# Altium project Longboard_32bit_ext.PrjPCB (part 4 of 6)

## Sheet DC_Power_Switching.SchDoc: STM32F412 CNC
size B; Author: AM; CompanyName: Expatria Technologies; DrawnBy: A.Marles; Engineer: AM; Organization: Expatria Technolgoies; Address1: PO Box 2084; Address3: Merritt, BC V1K 1B8; Address4: Canada; DocumentNumber: 22; Revision: B9; SheetNumber: 22; SheetTotal: 27
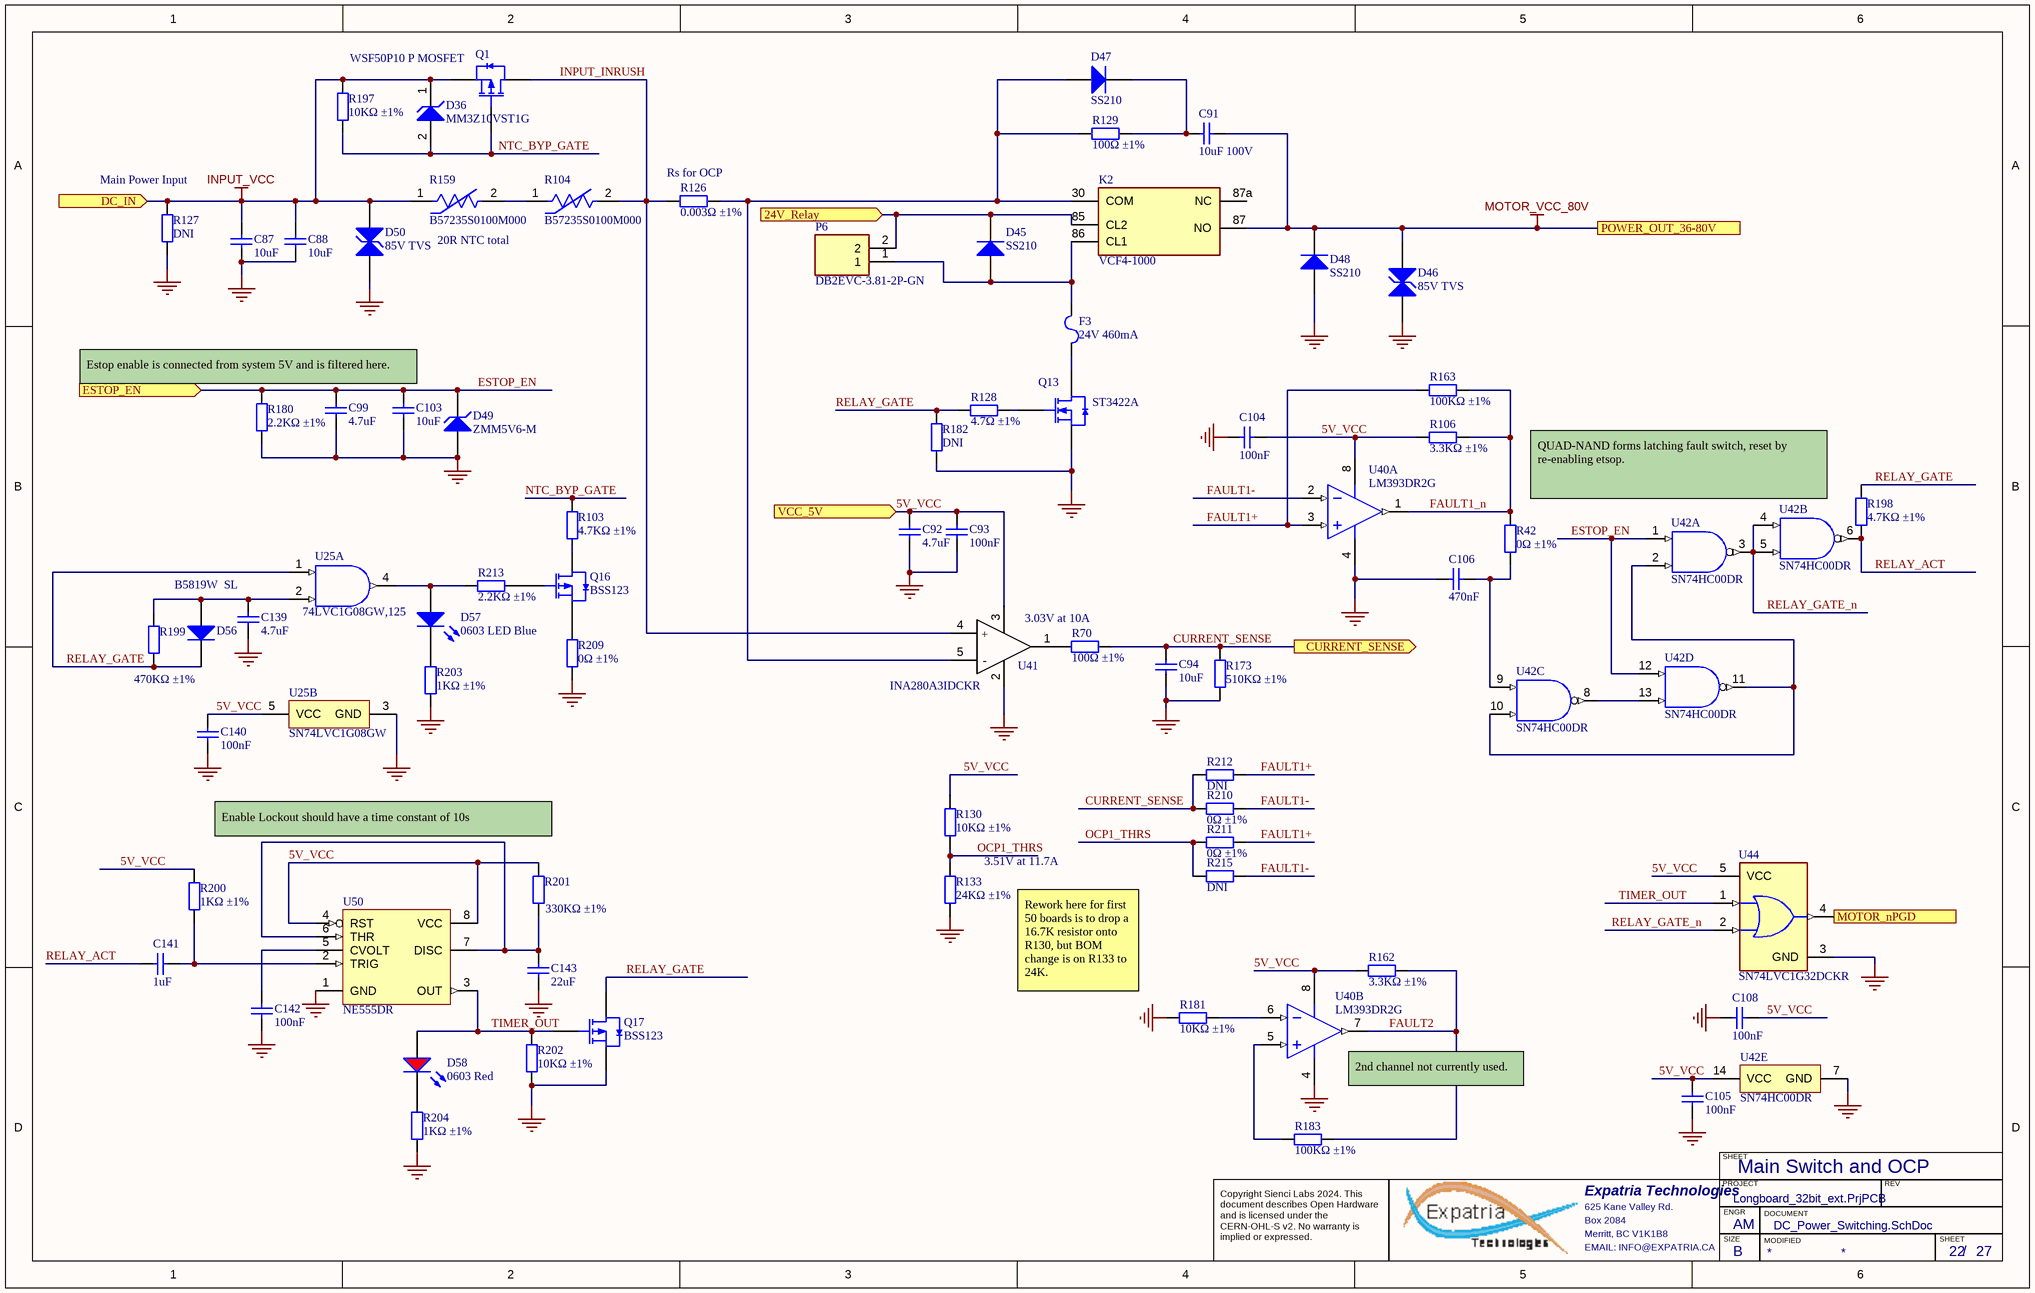
[diagram p15: DC_Power_Switching.SchDoc]

### Parts
C87  10uF  [1206_C]
C88  10uF  [1206_C]
C91  10uF 100V  [1210_C]
C92  4.7uF  [0603_C]
C93  100nF  [0603_C]
C94  10uF  [0603_C]
C99  4.7uF  [0603_C]
C103  10uF  [0603_C]
C104  100nF  [0603_C]
C105  100nF  [0603_C]
C106  470nF  [0603_C]
C108  100nF  [0603_C]
C139  4.7uF  [1206_C]
C140  100nF  [0603_C]
C141  1uF  [0603_C]
C142  100nF  [0603_C]
C143  22uF  [1206_C]
D36  MM3Z10VST1G  [ONSC-SOD-323-2-477-02_V]
D45  SS210  [SMA(DO-214AC)_S1]
D46  85V TVS  [SMB(DO-214AA)_S1]
D47  SS210  [SMA(DO-214AC)_S1]
D48  SS210  [SMA(DO-214AC)_S1]
D49  ZMM5V6-M  [LL-34]
D50  85V TVS  [SMB(DO-214AA)_S1]
D56  B5819W  SL  [SOD-123]
D57  0603 LED Blue  [0603_LED_S1 - BLUE]
D58  0603 Red  [0603_LED_S1]
F3  24V 460mA  [1206_C]
K2  VCF4-1000  [VCF41000]
P6  DB2EVC-3.81-2P-GN  [CONN-TH_5P-P3.81_DB2EVC-3.81-2p]
Q1  WSF50P10 P MOSFET  [TO-252-2-180]
Q13  ST3422A  [SOT-23-3L]
Q16  BSS123  [SOT-23-3L]
Q17  BSS123  [SOT-23-3L]
R42  0Ω ±1%  [0603_R]
R70  100Ω ±1%  [0603_R]
R103  4.7KΩ ±1%  [0603_R]
R104  B57235S0100M000  [RES-TH_L9.5-W6.0-P5.00-D0.6]
R106  3.3KΩ ±1%  [0603_R]
R126  0.003Ω ±1%  [1206_R]
R127  DNI  [0603_R]
R128  4.7Ω ±1%  [0603_R]
R129  100Ω ±1%  [1206_R]
R130  10KΩ ±1%  [0603_R]
R133  24KΩ ±1%  [0603_R]
R159  B57235S0100M000  [RES-TH_L9.5-W6.0-P5.00-D0.6]
R162  3.3KΩ ±1%  [0603_R]
R163  100KΩ ±1%  [0603_R]
R173  510KΩ ±1%  [0603_R]
R180  2.2KΩ ±1%  [0603_R]
R181  10KΩ ±1%  [0603_R]
R182  DNI  [0603_R]
R183  100KΩ ±1%  [0603_R]
R197  10KΩ ±1%  [0603_R]
R198  4.7KΩ ±1%  [0603_R]
R199  470KΩ ±1%  [0603_R]
R200  1KΩ ±1%  [0603_R]
R201  330KΩ ±1%  [0603_R]
R202  10KΩ ±1%  [0603_R]
R203  1KΩ ±1%  [0603_R]
R204  1KΩ ±1%  [0603_R]
R209  0Ω ±1%  [0603_R]
R210  0Ω ±1%  [0603_R]
R211  0Ω ±1%  [0603_R]
R212  DNI  [0603_R]
R213  2.2KΩ ±1%  [0603_R]
R215  DNI  [0603_R]
U25  74LVC1G08GW,125  [DCK0005A_M]  (parts A,B of 2)
U40  LM393DR2G  [SOIC-8_150mil]  (parts A,B of 2)
U41  INA280A3IDCKR  [SOT65P210X110-5N]
U42  SN74HC00DR  [D0014A_L]  (parts A,B,C,D,E of 5)
U44  SN74LVC1G32DCKR  [FP-DCK0005A-IPC_A]
U50  NE555DR  [SOIC-8_150mil]

### Ports
24V_Relay (in), CURRENT_SENSE (out), DC_IN (in), ESTOP_EN (in), MOTOR_nPGD (out), POWER_OUT_36-80V, VCC_5V (in)

### Nets
5V_VCC: C92.2 C93.2 C104.2 C105.2 C108.2 C140.2 R106.2 R130.2 R162.2 R200.2 R201.2 U25.5(VCC) U40.8(V+) U41.3(VS) U42.14(VCC) U44.5(VCC) U50.4(RST) U50.8(VCC) ; port VCC_5V  [project net VCC_SYS_5V0]
GND: C87.1 C88.1 C92.1 C93.1 C94.1 C99.1 C103.1 C104.1 C105.1 C106.2 C108.1 C139.1 C140.1 C142.1 C143.1 D46.1(A) D48.1(A) D49.1(A) D50.1(A) Q13.2(S) Q17.2(S) R127.1 R133.1 R173.1 R180.1 R181.2 R182.1 R202.1 R203.1 R204.1 R209.1 U25.3(GND) U40.4(GND) U41.2(GND) U42.7(GND) U44.3(GND) U50.1(GND)
INPUT_VCC: C87.2 C88.2 D36.1(K) D50.2(K) Q1.3(S) R127.2 R159.1 R197.2 ; port DC_IN
MOTOR_VCC_80V: C91.2 D46.2(K) D48.2(K) K2.87(NO) ; port POWER_OUT_36-80V
VCC_SYS_24V0: D45.2(K) K2.85(CL2) P6.2 ; port 24V_Relay
CURRENT_SENSE: C94.2 R70.2 R173.2 R210.2 R212.2 ; port CURRENT_SENSE
ESTOP_EN: C99.2 C103.2 D49.2(K) R180.2 U42.1(1A) U42.12(4A) ; port ESTOP_EN  [project net ESTOP_5V_EN]
FAULT1+: R163.1 R211.1 R212.1 U40.3(IN+)
FAULT1-: R210.1 R215.1 U40.2(IN-)
FAULT1_n: R42.2 R106.1 R163.2 U40.1(OUT)
FAULT2: R162.1 R183.2 U40.7(OUT)
INPUT_INRUSH: Q1.2(D) R104.2 R126.2 U41.4(IN+)
MOTOR_nPGD: U44.4(Y) ; port MOTOR_nPGD
NTC_BYP_GATE: D36.2(A) Q1.1(G) R103.2 R197.1
OCP1_THRS: R130.1 R133.2 R211.2 R215.2
RELAY_ACT: C141.2 R198.1 U42.6(2Y)
RELAY_GATE: D56.2(K) Q17.3(D) R128.1 R182.2 R198.2 R199.1 U25.1(A)
RELAY_GATE_n: U42.3(1Y) U42.4(2A) U42.5(2B) U44.2(B)
TIMER_OUT: D58.A Q17.1(G) R202.2 U44.1(A) U50.3(OUT)
NetC91_1: C91.1 D47.2(K) R129.2
NetC106_1: C106.1 R42.1 U42.9(3A)
NetC139_2: C139.2 D56.1(A) R199.2 U25.2(B)
NetC141_1: C141.1 R200.1 U50.2(TRIG)
NetC142_2: C142.2 U50.5(CVOLT)
NetC143_2: C143.2 R201.1 U50.6(THR) U50.7(DISC)
NetD45_1: D45.1(A) F3.2 K2.86(CL1) P6.1
NetD47_1: D47.1(A) K2.30(COM) R126.1 R129.1 U41.5(IN-)
NetD57_A: D57.A R213.2 U25.4(Y)
NetD57_K: D57.K R203.2
NetD58_K: D58.K R204.2
NetF3_1: F3.1 Q13.3(D)
NetQ13_1: Q13.1(G) R128.2
NetQ16_1: Q16.1(G) R213.1
NetQ16_2: Q16.2(S) R209.2
NetQ16_3: Q16.3(D) R103.1
NetR70_1: R70.1 U41.1(OUT)
NetR104_1: R104.1 R159.2
NetR181_1: R181.1 U40.6(IN-)
NetR183_1: R183.1 U40.5(IN+)
NetU42_2: U42.2(1B) U42.10(3B) U42.11(4Y)
NetU42_8: U42.8(3Y) U42.13(4B)

Not connected (* = marked no-connect by the designer): K2 87a(NC)

### Notes on the sheet
- (near R127) Main Power Input
- (near R126) Rs for OCP
- 20R NTC total
- Estop enable is connected from system 5V and is filtered here.
- QUAD-NAND forms latching fault switch, reset by re-enabling etsop.
- (near U41) 3.03V at 10A
- Enable Lockout should have a time constant of 10s
- 3.51V at 11.7A
- Rework here for first 50 boards is to drop a 16.7K resistor onto R130, but BOM change is on R133 to 24K.
- (near U40) 2nd channel not currently used.
- Main Switch and OCP
- SHEET
- Expatria Technologies
- 625 Kane Valley Rd.
- Box 2084
- Merritt, BC V1K1B8
- PROJECT
- SIZE
- ENGR
- MODIFIED
- DOCUMENT
- REV
- Copyright Sienci Labs 2024. This document describes Open Hardware and is licensed under the CERN-OHL-S v2. No warranty is implied or expressed.
- EMAIL: INFO@EXPATRIA.CA
- B
- /
- (in symbol INA280A3IDCKR) +; -

### Library data of the parts
C87 C88 = 1206 10uF (106) 10% 50V: 50V 10uF X5R ±10% 1206 Multilayer Ceramic Capacitors MLCC - SMD/SMT ROHS; Manufacturer: Samsung Electro-Mechanics; Manufacturer Part Number: CL31A106KBHNNNE; Package: 1206; Supplier: LC; SuppliersPartNumber: C13585; Capacitance: 10uF; Tolerance: 10%; Voltage: 50V
C91 = 1210 10uF (106) 10% 100V: Chip capacitors; Manufacturer: Murata; Manufacturer Part Number: GRM32EC72A106KE05L; Tolerance: 10%; Package: 1210; Supplier: LC; SuppliersPartNumber: C576517; Capacitance: 10uF; Voltage: 100V
C92 C99 = 0603 4.7uF (475) 10% 16V: 16V 4.7uF X5R ±10% 0603 Multilayer Ceramic Capacitors MLCC - SMD/SMT ROHS; Manufacturer: Samsung Electro-Mechanics; Manufacturer Part Number: CL10A475KO8NNNC; ComponentLink1Description: Supplier link; ComponentLink1URL: http://www.szlcsc.com/product/details_20375.html; Package: 0603; Supplier: LC; SuppliersPartNumber: C19666; Capacitance: 4.7uF; Tolerance: 10%; Voltage: 16V
C93 C104 C105 C108 C140 C142 = 0603 100nF (104) 10% 50V: 50V 100nF X7R ±10% 0603 Multilayer Ceramic Capacitors MLCC - SMD/SMT ROHS; Manufacturer: YAGEO; Manufacturer Part Number: CC0603KRX7R9BB104; Package: 0603; Supplier: LC; SuppliersPartNumber: C14663; Capacitance: 100nF; Tolerance: 10%; Voltage: 50V; ComponentLink1Description: Supplier link; ComponentLink1URL: http://www.szlcsc.com/product/details_15331.html
C94 = 0603 10uF (106) 10% 10V: Chip capacitors; Manufacturer: Samsung Electro-Mechanics; PartNumber: CL10A106KP8NNNC; Tolerance: 10%; Voltage: 10V; Package: 0603; Supplier: LC; SuppliersPartNumber: C19702; Capacitance: 10uF; ComponentLink1Description: Supplier link; ComponentLink1URL: http://www.szlcsc.com/product/details_20411.html
C103 = 0603 10uF (106) 10% 10V: Chip capacitors; Manufacturer: Samsung Electro-Mechanics; Manufacturer Part Number: CL10A106KP8NNNC; Tolerance: 10%; Voltage: 10V; ComponentLink1Description: Supplier link; ComponentLink1URL: http://www.szlcsc.com/product/details_20411.html; Package: 0603; Supplier: LC; SuppliersPartNumber: C19702; Capacitance: 10uF
C106 = 0603 470nF (474) 10% 25V: Chip capacitors; Manufacturer: Samsung Electro-Mechanics; Manufacturer Part Number: CL10B474KA8NNNC; Tolerance: 10%; Voltage: 25V; Package: 0603; Supplier: LC; SuppliersPartNumber: C1623; Capacitance: 470nF; ComponentLink1Description: Supplier link; ComponentLink1URL: http://www.szlcsc.com/product/details_1975.html
C139 = 1206 4.7uF (475) 10% 50V: Chip capacitors; Manufacturer: Guangdong Fenghua Advanced Tech; Manufacturer Part Number: 1206B475K500NT; Tolerance: 10%; Voltage: 50V; ComponentLink1Description: Supplier link; ComponentLink1URL: http://www.szlcsc.com/product/details_30577.html; Package: 1206; Supplier: LC; SuppliersPartNumber: C29823; Capacitance: 4.7uF
C141 = 0603 1uF (105) 10% 50V: as C9 on sheet RS485; Package: 0603; Supplier: LC; SuppliersPartNumber: C15849; Capacitance: 1uF; ComponentLink1Description: Supplier link; ComponentLink1URL: http://www.szlcsc.com/product/details_16531.html
C143 = 1206 4.7uF (475) 10% 50V: Chip capacitors; Manufacturer: Samsung; Manufacturer Part Number: CL31A226KAHNNNE; Tolerance: 10%; Voltage: 25V; ComponentLink1Description: Supplier link; ComponentLink1URL: http://www.szlcsc.com/product/details_30577.html; Package: 1206; Supplier: LC; SuppliersPartNumber: C12891; Capacitance: 22uF
D36 = MM3Z10VST1G: MM3Z10VST1G Zener Diode, 10V 2% 300 mW SMT 2-Pin SOD-323 | ON Semiconductor MM3Z10VST1G; Packing: Tape and Reel; P Max (W): 0.3; Material: Plastic; Max Power Dissipation: 300mW; Forward Voltage: 900mV; Impedance: 15R; Max Reverse Leakage Current: 500nA; Power Dissipation: 200mW; Test Current: 5mA; Forward Current: 10mA; Reverse Voltage: 6V; PackageVersion: Rev. H, 03/2007; Mounting Technology: Surface Mount; RoHS: Pb-Free; ComponentLink1Description: Manufacturer URL; ComponentLink3URL: http://www.onsemi.com/pub_link/Collateral/477-02.PDF.1; ComponentLink2Description: Datasheet; PackageDescription: 2-Pin SOD, Body 1.7 x 1.25 mm; PackageReference: SOD-323-2-477-02; Manufacturer Part Number: MM3Z10VST1G; ComponentLink2URL: http://www.onsemi.cn/pub_link/Collateral/MM3Z2V4ST1-D.PDF; ComponentLink1URL: http://www.onsemi.com/; DatasheetVersion: Rev. 21; ComponentLink3Description: Package Specification; Manufacturer: On Semiconductor; Supplier: LCSC; Category: Zener Diodes; Case/Package: SOD-323-2; Number of Pins: 2; Min Operating Temperature: -65°C; Max Operating Temperature: 150°C; Packaging: Tape and Reel; Zener Voltage: 10V; Package Quantity: 3000; Max Reverse Current: 500nA; Series: -; Tolerance: 2%; Voltage Tolerance: 2%; Working Voltage: 10V; Voltage Rating (DC): 10V; Power Rating: 200mW; Length: 1.8mm; Width: 1.35mm; Height: 1mm; Radiation Hardening: No; Lead Free: Lead Free; RoHS Compliant: Yes; Reach SVHC Compliant: No; ComponentLink4URL: https://datasheet.ciiva.com/15142/getdatasheetpartid-68935-15142333.pdf?src-supplier=Verical; ComponentLink4Description: https://datasheet.ciiva.com/15142/getdatasheetpartid-68935-15142333.pdf?src-supplier=Verical; ComponentLink5URL: https://datasheet.ciiva.com/8347/mm3z2v4st1-d-8347637.pdf?src-supplier=Avnet; ComponentLink5Description: https://datasheet.ciiva.com/8347/mm3z2v4st1-d-8347637.pdf?src-supplier=Avnet; ComponentLink6URL: https://datasheet.ciiva.com/10637/mm3z2v4st1-d-10637802.pdf?src-supplier=Avnet; ComponentLink6Description: https://datasheet.ciiva.com/10637/mm3z2v4st1-d-10637802.pdf?src-supplier=Avnet; ComponentLink7URL: https://datasheet.ciiva.com/894/mm3z2v4st1-d-894658.pdf?src-supplier=Digikey; ComponentLink7Description: https://datasheet.ciiva.com/894/mm3z2v4st1-d-894658.pdf?src-supplier=Digikey; ComponentLink8URL: https://datasheet.ciiva.com/894/mm3z2v4st1-d-894659.pdf?src-supplier=Digikey; ComponentLink8Description: https://datasheet.ciiva.com/894/mm3z2v4st1-d-894659.pdf?src-supplier=Digikey; ComponentLink9URL: https://datasheet.ciiva.com/894/mm3z2v4st1-d-894660.pdf?src-supplier=Digikey; ComponentLink9Description: https://datasheet.ciiva.com/894/mm3z2v4st1-d-894660.pdf?src-supplier=Digikey; Value: MM3Z10VST1G; SuppliersPartNumber: C235983
D45 D47 D48 = SMA(DO-214AC) SS210: 100V 2A 850mV @ 2A SMA(DO-214AC) Schottky Barrier Diodes (SBD) ROHS; Manufacturer: MDD(Microdiode Electronics); ComponentLink1Description: 供应商链接; ComponentLink1URL: http://www.szlcsc.com/product/details_15669.html; Package: SMA(DO-214AC); Supplier: LC; SuppliersPartNumber: C14996; Manufacturer Part Number: SS210
D46 D50 = SMBJ85CA: 4.4A 137V 94.4V 85V DO-214AA Electrostatic and Surge Protection (TVS/ESD) ROHS; Manufacturer: BORN; ComponentLink1Description: 供应商链接; ComponentLink1URL: http://www.szlcsc.com/product/details_79530.html; Package: SMB/DO-214AA; Supplier: LC; SuppliersPartNumber: C2842381; Manufacturer Part Number: SMBJ85CA
D49 = LL-34 ZMM5V6-M: Single 500mW 5.2V~6V 5.6V LL-34 Zener Diodes ROHS; Manufacturer Part Number: ZMM5V6; Manufacturer: HXY MOSFET; Package: LL-34; Supplier: LC; SuppliersPartNumber: C5345993
D56 = B5819W  SL: 40V 600mV@1A 1A SOD-123 Schottky Barrier Diodes (SBD) ROHS; Manufacturer: Jiangsu Changjing Electronics Technology Co., Ltd.; ComponentLink1Description: 供应商链接; ComponentLink1URL: http://www.szlcsc.com/product/details_9093.html; Package: SOD-123; Supplier: LC; SuppliersPartNumber: C8598; Manufacturer Part Number: B5819W SL
D57 = 0603 LED Blue: 5mA -40℃~+85℃ Blue 120° 0603 Light Emitting Diodes (LED) ROHS; Manufacturer: TUOZHAN; Manufacturer Part Number: F.0603.00026/P2-0603B1TS2-06T-001; Package: 0603; Supplier: LC; SuppliersPartNumber: C7496819; Color: Blue
D58 = KT-0603R: as D28 on sheet Spindle_Control; Package: 0603; Supplier: LC; SuppliersPartNumber: C2286; Color: Red; Manufacturer Part Number: KT-0603R; Value: 0603 Red
F3 = JK-nSMD050-24: 24V 200mA 100A 460mA - Resettable Fuses ROHS; Manufacturer: Jinrui Electronic Materials Co.; PartNumber: JK-nSMD020-24; Package: 1206; Supplier: LC; SuppliersPartNumber: C5307785
K2 = VCF4-1000: RELAY SOCKET, 5 PIN, THROUGH HOLE; Available until stocks are exhausted Alternative available; Manufacturer: TE Connectivity; Number of Poles: 1; Number of Positions: 5; Datasheet Link: http://www.te.com/commerce/DocumentDelivery/DDEController?Action=showdoc&DocId=Customer+Drawing%7FVCF4-1000%7FB%7Fpdf%7FEnglish%7FENG_CD_VCF4-1000_B.pdf%7F1393310-3; Height: 14.5796mm; Mouser Part Number: 655-VCF4-1000; Mouser Price/Stock: https://www.mouser.co.uk/ProductDetail/TE-Connectivity-PB/VCF4-1000?qs=s%252BA%252BrP651c6TIC6VhCBWvA%3D%3D; Arrow Part Number: VCF4-1000; Arrow Price/Stock: https://www.arrow.com/en/products/vcf4-1000/te-connectivity?region=nac; Manufacturer Part Number: VCF4-1000; Supplier: Mouser; Supplier Part Number: 655-VCF4-1000; RoHS: Yes; Category: Relays; Mount: Through Hole,PCB; Number of Pins: 5; Min Operating Temperature: -40°C; Max Operating Temperature: 125°C; Orientation: Straight; Package Quantity: 50; Termination: Quick Connect; Number of Contacts: 5; Series: VF4; RoHS Compliant: Yes; Reach SVHC Compliant: No; ELV: 5681ELVCompliant; Lead Free: 5697LeadFree; ComponentLink1URL: https://datasheet.ciiva.com/1523/1650964-1523176.pdf?src-supplier=Element14; ComponentLink1Description: https://datasheet.ciiva.com/1523/1650964-1523176.pdf?src-supplier=Element14; Parameter 1: *; SuppliersPartNumber: C1519211
P6 = DB2EVC-3.81-2P-GN: 3.81mm Green Board Edge/Receptacle-Close Push-Pull,P=3.81mm Pluggable System Terminal Block ROHS; Manufacturer: DIBO; SuppliersPartNumber: C395686; Manufacturer Part Number: DB2EVC-3.81-2P-GN; Supplier: LCSC; Value: DB2EVC-3.81-2P-GN
Q1 = WSF50P10 P TO-252-2: 100V 34A 32mΩ@10V,18A 96W P Channel TO-252-2 MOSFETs ROHS; Manufacturer: Winsok Semicon; ComponentLink1Description: 供应商链接; ComponentLink1URL: http://www.szlcsc.com/product/details_15801.html; Package: TO-252-2; Supplier: LC; SuppliersPartNumber: C2758447; Manufacturer Part Number: WSF50P10
Q13 = ST3422A: 60V 6A 28mΩ@10V,6A 2W 3V@250uA 38pF@15V N Channel 455pF@15V 10nC@10V -55℃~+150℃@(Tj) SOT-23-3L MOSFETs ROHS; Manufacturer: STANSON Tech.; Package: SOT-23; Supplier: LCSC; SuppliersPartNumber: C2682907; Manufacturer Part Number: ST3422A; Value: ST3422A
Q16 Q17 = BSS123: 100V 170mA 6Ω@10V 350mW 2.5V@250uA N Channel SOT-23 MOSFETs ROHS; Manufacturer: HXY MOSFET; Package: SOT-23; Supplier: LC; SuppliersPartNumber: C5184436; Manufacturer Part Number: BSS123
R42 R209-R211 = 0603 0R (0R0) 1%: as R2-R4 on sheet Ethernet_Interface; ComponentLink1Description: Supplier link; ComponentLink1URL: http://www.szlcsc.com/product/details_21903.html; Package: 0603; Supplier: LC; SuppliersPartNumber: C21189; Resistance: 0Ω; Tolerance: 1%
R70 = 0603 100R (1000) 1%: Chip resistor; Manufacturer: Uniroyal Elec; PartNumber: 0603WAF1000T5E; Power: 1/10W; ComponentLink1Description: Supplier link; ComponentLink1URL: http://www.szlcsc.com/product/details_23502.html; Package: 0603; Supplier: LC; SuppliersPartNumber: C22775; Resistance: 100Ω; Tolerance: 1%
R103 R198 = 0603 4.7K (4701) 1%: Chip resistor; Manufacturer: Uniroyal Elec; Manufacturer Part Number: 0603WAF4701T5E; Power: 1/10W; ComponentLink1Description: Supplier link; ComponentLink1URL: http://www.szlcsc.com/product/details_23889.html; Package: 0603; Supplier: LC; SuppliersPartNumber: C23162; Resistance: 4.7KΩ; Tolerance: 1%
R104 R159 = B57235S0259M000: Inrush Current Limiter 10 Ohms ±20% 3A 0.374" (9.50mm); Manufacturer: TDK; SuppliersPartNumber: C125456; Supplier: LC; Manufacturer Part Number: B57235S0100M000
R106 R162 = 0603 3.3K (3301) 1%: Chip resistor; Manufacturer: Uniroyal Elec; Manufacturer Part Number: 0603WAF3301T5E; Power: 1/10W; ComponentLink1Description: Supplier link; ComponentLink1URL: http://www.szlcsc.com/product/details_23705.html; Package: 0603; Supplier: LC; SuppliersPartNumber: C22978; Resistance: 3.3KΩ; Tolerance: 1%
R126 = 1206 0.003R (R50) 1%: Chip Resistor; Manufacturer: Vishay; Manufacturer Part Number: WFC12063L000FE66; Power: 1/4W; ComponentLink1Description: Supplier link; ComponentLink1URL: http://www.szlcsc.com/product/details_26077.html; Package: 1206; Supplier: LC; SuppliersPartNumber: C4286667; Tolerance: 1%
R127 R182 = 0603 10K (1002) 1%: Chip resistor; Manufacturer: Uniroyal Elec; Manufacturer Part Number: 0603WAF1002T5E; Power: 1/10W; Resistance: 10KΩ; Tolerance: 1%; ComponentLink1Description: Supplier link; ComponentLink1URL: http://www.szlcsc.com/product/details_26547.html; Package: 0603; Supplier: LC; SuppliersPartNumber: C25804
R128 = 0603 4.7R (4R70) 1%: Chip resistor; Manufacturer: Uniroyal Elec; Manufacturer Part Number: 0603WAF470KT5E; Power: 1/10W; ComponentLink1Description: Supplier link; ComponentLink1URL: http://www.szlcsc.com/product/details_23891.html; Package: 0603; Supplier: LC; SuppliersPartNumber: C23164; Resistance: 4.7Ω; Tolerance: 1%
R129 = 1206 100R (1000) 1%: Chip resistor; Manufacturer: Uniroyal Elec; Manufacturer Part Number: 1206W4F1000T5E; Power: 1/4W; ComponentLink1Description: Supplier link; ComponentLink1URL: http://www.szlcsc.com/product/details_18589.html; Package: 1206; Supplier: LC; SuppliersPartNumber: C17901; Tolerance: 1%
R130 R181 R197 R202 = 0603 10K (1002) 1%: as R143 on sheet Ethernet_Interface; ComponentLink1Description: Supplier link; ComponentLink1URL: http://www.szlcsc.com/product/details_26547.html; Package: 0603; Supplier: LC; SuppliersPartNumber: C25804; Resistance: 10KΩ; Tolerance: 1%
R133 = 0603 24K (2402) 1%: Chip resistor; Manufacturer: Uniroyal Elec; PartNumber: 0603WAF2402T5E; Power: 1/10W; ComponentLink1Description: Supplier link; ComponentLink1URL: http://www.szlcsc.com/product/details_24085.html; Package: 0603; Supplier: LC; SuppliersPartNumber: C23352; Resistance: 24KΩ; Tolerance: 1%
R163 R183 = 0603 100K (1003) 1%: Chip resistor; Manufacturer: Uniroyal Elec; Manufacturer Part Number: 0603WAF1003T5E; Power: 1/10W; ComponentLink1Description: Supplier link; ComponentLink1URL: http://www.szlcsc.com/product/details_26546.html; Package: 0603; Supplier: LC; SuppliersPartNumber: C25803; Resistance: 100KΩ; Tolerance: 1%
R173 = 0603 510K (5103) 1%: Chip resistor; Manufacturer: Uniroyal Elec; Manufacturer Part Number: 0603WAF5103T5E; Power: 1/10W; ComponentLink1Description: Supplier link; ComponentLink1URL: http://www.szlcsc.com/product/details_23919.html; Package: 0603; Supplier: LC; SuppliersPartNumber: C23192; Resistance: 510KΩ; Tolerance: 1%
R180 R213 = 0603 2.2K (2201) 1%: Chip resistor; Manufacturer: Uniroyal Elec; Manufacturer Part Number: 0603WAF2201T5E; Power: 1/10W; ComponentLink1Description: Supplier link; ComponentLink1URL: http://www.szlcsc.com/product/details_4597.html; Package: 0603; Supplier: LC; SuppliersPartNumber: C4190; Resistance: 2.2KΩ; Tolerance: 1%
R199 = 0603 470K (4703) 1%: Chip resistor; Manufacturer: Uniroyal Elec; Manufacturer Part Number: 0603WAF4703T5E; Power: 1/10W; ComponentLink1Description: Supplier link; ComponentLink1URL: http://www.szlcsc.com/product/details_23905.html; Package: 0603; Supplier: LC; SuppliersPartNumber: C23178; Resistance: 470KΩ; Tolerance: 1%
R200 R203 R204 = 0603 1K (1001) 1%: as R111 on sheet DC_Power_Regulation; ComponentLink1Description: Supplier link; ComponentLink1URL: http://www.szlcsc.com/product/details_21904.html; Package: 0603; Supplier: LC; SuppliersPartNumber: C21190; Resistance: 1KΩ; Tolerance: 1%
R201 = 0603 330K (3303) 1%: Chip resistor; Manufacturer: Uniroyal Elec; Manufacturer Part Number: 0603WAF3303T5E; Power: 1/10W; ComponentLink1Description: Supplier link; ComponentLink1URL: http://www.szlcsc.com/product/details_23864.html; Package: 0603; Supplier: LC; SuppliersPartNumber: C23137; Resistance: 330KΩ; Tolerance: 1%
R212 R215 = 0603 0R (0R0) 1%: Chip resistor; Manufacturer: Uniroyal Elec; Manufacturer Part Number: 0603WAF0000T5E; Power: 1/10W; Resistance: 0Ω; Tolerance: 1%; ComponentLink1Description: Supplier link; ComponentLink1URL: http://www.szlcsc.com/product/details_21903.html; Package: 0603; Supplier: LC; SuppliersPartNumber: C21189
U25 = CMP-0859-00266-3: Single 2-Input Positive-AND Gate, DCK0005A; Generic Part Number: SN74LVC1G08; Manufacturer: Nexperia; SuppliersPartNumber: C12512; Supplier: LC; Manufacturer Part Number: 74LVC1G08GW,125
U40 = LM393DR2G_[C7955]: IC COMPARATOR DUAL OFFSET LV 8SOIC; Manufacturer: onsemi; ComponentLink1Description: 供应商链接; ComponentLink1URL: http://www.szlcsc.com/product/details_8432.html; Package: SOIC-8; Supplier: LC; SuppliersPartNumber: C7955; Manufacturer Part Number: LM393DR2G
U41 = INA280A3IDCKR: 2.7-V to 120-V, 1.1-MHz, high-precision current sense amplifier in small (SC-70) package 5-SC70 -40 to 125; Manufacturer 1: Texas Instruments; TYPE: TYPE; RefDes: RefDes; Supplier: LCSC; Supplier Part Number: C2868045; Manufacturer: Texas Instruments; Manufacturer Part Number: INA280A3IDCKR; RoHS: Yes; Category: Amplifiers - Op Amps, Buffer, Instrumentation; SuppliersPartNumber: C2868045
U42 = SN74HC00DR: 4-ch, 2-input, 2-V to 6-V 5.2 mA drive strength NAND gate 14-SOIC -40 to 85; Manufacturer: Texas Instruments; tpd @ Nom Voltage(Max)(ns): 23; Rating: Catalog; F @ Nom Voltage(Max)(Mhz): 70; Input Type: CMOS; VCC(Min)(V): 2; VCC(Max)(V): 6; Technology Family: HC; Voltage(Nom)(V): 5; Schmitt Trigger: Yes; ICC @ Nom Voltage(Max)(mA): 0.02; Output Drive (IOL/IOH)(Max)(mA): 5.2/-5.2; Bits(#): 4; Propagation Delay: 20ns; Max Supply Voltage: 6V; Min Supply Voltage: 2V; Output Current: 25mA; Quiescent Current: 2uA; High Level Output Current: -5.2mA; Low Level Output Current: 5.2mA; Number of Output Lines: 1; Operating Supply Voltage: 5V; Turn-On Delay Time: 23ns; PackageReference: D0014A; DatasheetVersion: SCLS181E; Output Type: CMOS; Generic Part Number: SN74HC00; Code_JEDEC: MS-012; Operating Temperature Range(C): -40 to 85; Manufacturer Part Number: SN74HC00D; Supplier: LCSC; SuppliersPartNumber: C10090; RoHS: Yes; Category: Logic Gates; Mount: Surface Mount; Case/Package: SOIC; Number of Pins: 14; Weight: 0.004318oz; Min Operating Temperature: -40°C; Max Operating Temperature: 85°C; Packaging: Tape and Reel; Number of Inputs: 2; Logic Function: NAND GATE; Package Quantity: 2500; Number of Circuits: 4; Number of Gates: 4; Number of Input Lines: 2; Number of Bits: 4; Series: 74HC; Number of Outputs: 1; Number of Elements: 4; Technology: CMOS; Radiation Hardening: No; RoHS Compliant: Yes; Lead Free: Lead Free; Reach SVHC Compliant: No; Value: SN74HC00DR
U44 = SN74LVC1G32DCKR: 1-ch, 2-input 1.65-V to 5.5-V 32-mA drive strength OR gate 5-SC70 -40 to 125; Manufacturer: Texas Instruments; Turn-On Delay Time: 4.5ns; Schmitt Trigger Input: No; Number of Bits: 1; High Level Output Current: -32mA; Max Supply Voltage: 5.5V; Propagation Delay: 4ns; Max Output Current: 32mA; Min Supply Voltage: 1.65V; Number of Input Lines: 2; Quiescent Current: 10uA; Number of Channels: 1NUMBER; Case/Package: SC; Weight: 8.8E-05oz; Logic Function: OR; Package Quantity: 1; Packaging: Tape and Reel; Mount: Surface Mount; Max Operating Temperature: 125°C; Output Current: 32mA; Length: 2mm; Contact Plating: Gold; Number of Output Lines: 1; Height: 0.9mm; Number of Pins: 5; Width: 1.25mm; REACH SVHC: No SVHC; Number of Circuits: 1; Radiation Hardening: No; Number of Elements: 1; Low Level Output Current: 32mA; Number of Outputs: 1; Min Operating Temperature: -40°C; Number of Inputs: 2; Lead Free: Lead Free; Termination: SMD/SMT; Number of Gates: 1; Manufacturer Part Number: SN74LVC1G32DCKR; RoHS: Yes; Category: Logic Gates; Series: 74LVC; Technology: CMOS; Min Supply Voltage (DC): 1.65V; Nominal Supply Current: 10uA; Thickness: 900um; Reach SVHC Compliant: No; RoHS Compliant: Yes; ComponentLink1URL: https://datasheet.ciiva.com/6124/1768050-6124560.pdf?src-supplier=Farnell; ComponentLink1Description: https://datasheet.ciiva.com/6124/1768050-6124560.pdf?src-supplier=Farnell; ComponentLink2URL: https://datasheet.ciiva.com/1864/sn74lvc1g32-1864192.pdf?src-supplier=Digikey; ComponentLink2Description: https://datasheet.ciiva.com/1864/sn74lvc1g32-1864192.pdf?src-supplier=Digikey; ComponentLink3URL: https://datasheet.ciiva.com/27049/756781-27049784.pdf?src-supplier=Jameco; ComponentLink3Description: https://datasheet.ciiva.com/27049/756781-27049784.pdf?src-supplier=Jameco; ComponentLink4URL: https://datasheet.ciiva.com/7783/1768050-7783469.pdf?src-supplier=Element14; ComponentLink4Description: https://datasheet.ciiva.com/7783/1768050-7783469.pdf?src-supplier=Element14; ComponentLink5URL: https://datasheet.ciiva.com/7783/1768050-7783470.pdf?src-supplier=Element14; ComponentLink5Description: https://datasheet.ciiva.com/7783/1768050-7783470.pdf?src-supplier=Element14; ComponentLink6URL: https://datasheet.ciiva.com/1864/sn74lvc1g32-1864191.pdf?src-supplier=Digikey; ComponentLink6Description: https://datasheet.ciiva.com/1864/sn74lvc1g32-1864191.pdf?src-supplier=Digikey; ComponentLink7URL: https://datasheet.ciiva.com/1864/sn74lvc1g32-1864193.pdf?src-supplier=Digikey; ComponentLink7Description: https://datasheet.ciiva.com/1864/sn74lvc1g32-1864193.pdf?src-supplier=Digikey; Supplier: LCSC; SuppliersPartNumber: C7840
U50 = NE555DR_[C7593]: 100kHz SOIC-8 Timers / Clock Oscillators ROHS; Manufacturer: Texas Instruments; ComponentLink1Description: 供应商链接; ComponentLink1URL: http://www.szlcsc.com/product/details_8070.html; Package: SOIC-8_150mil; Supplier: LC; SuppliersPartNumber: C7593; Manufacturer Part Number: NE555DR

## Sheet Stepper_driver_group.SchDoc: STM32F412 CNC
size C; Author: AM; CompanyName: Expatria Technologies; DrawnBy: A.Marles; Engineer: AM; Organization: Expatria Technolgoies; Address1: PO Box 2084; Address3: Merritt, BC V1K 1B8; Address4: Canada; DocumentNumber: 8; Revision: B9; SheetNumber: 8; SheetTotal: 27
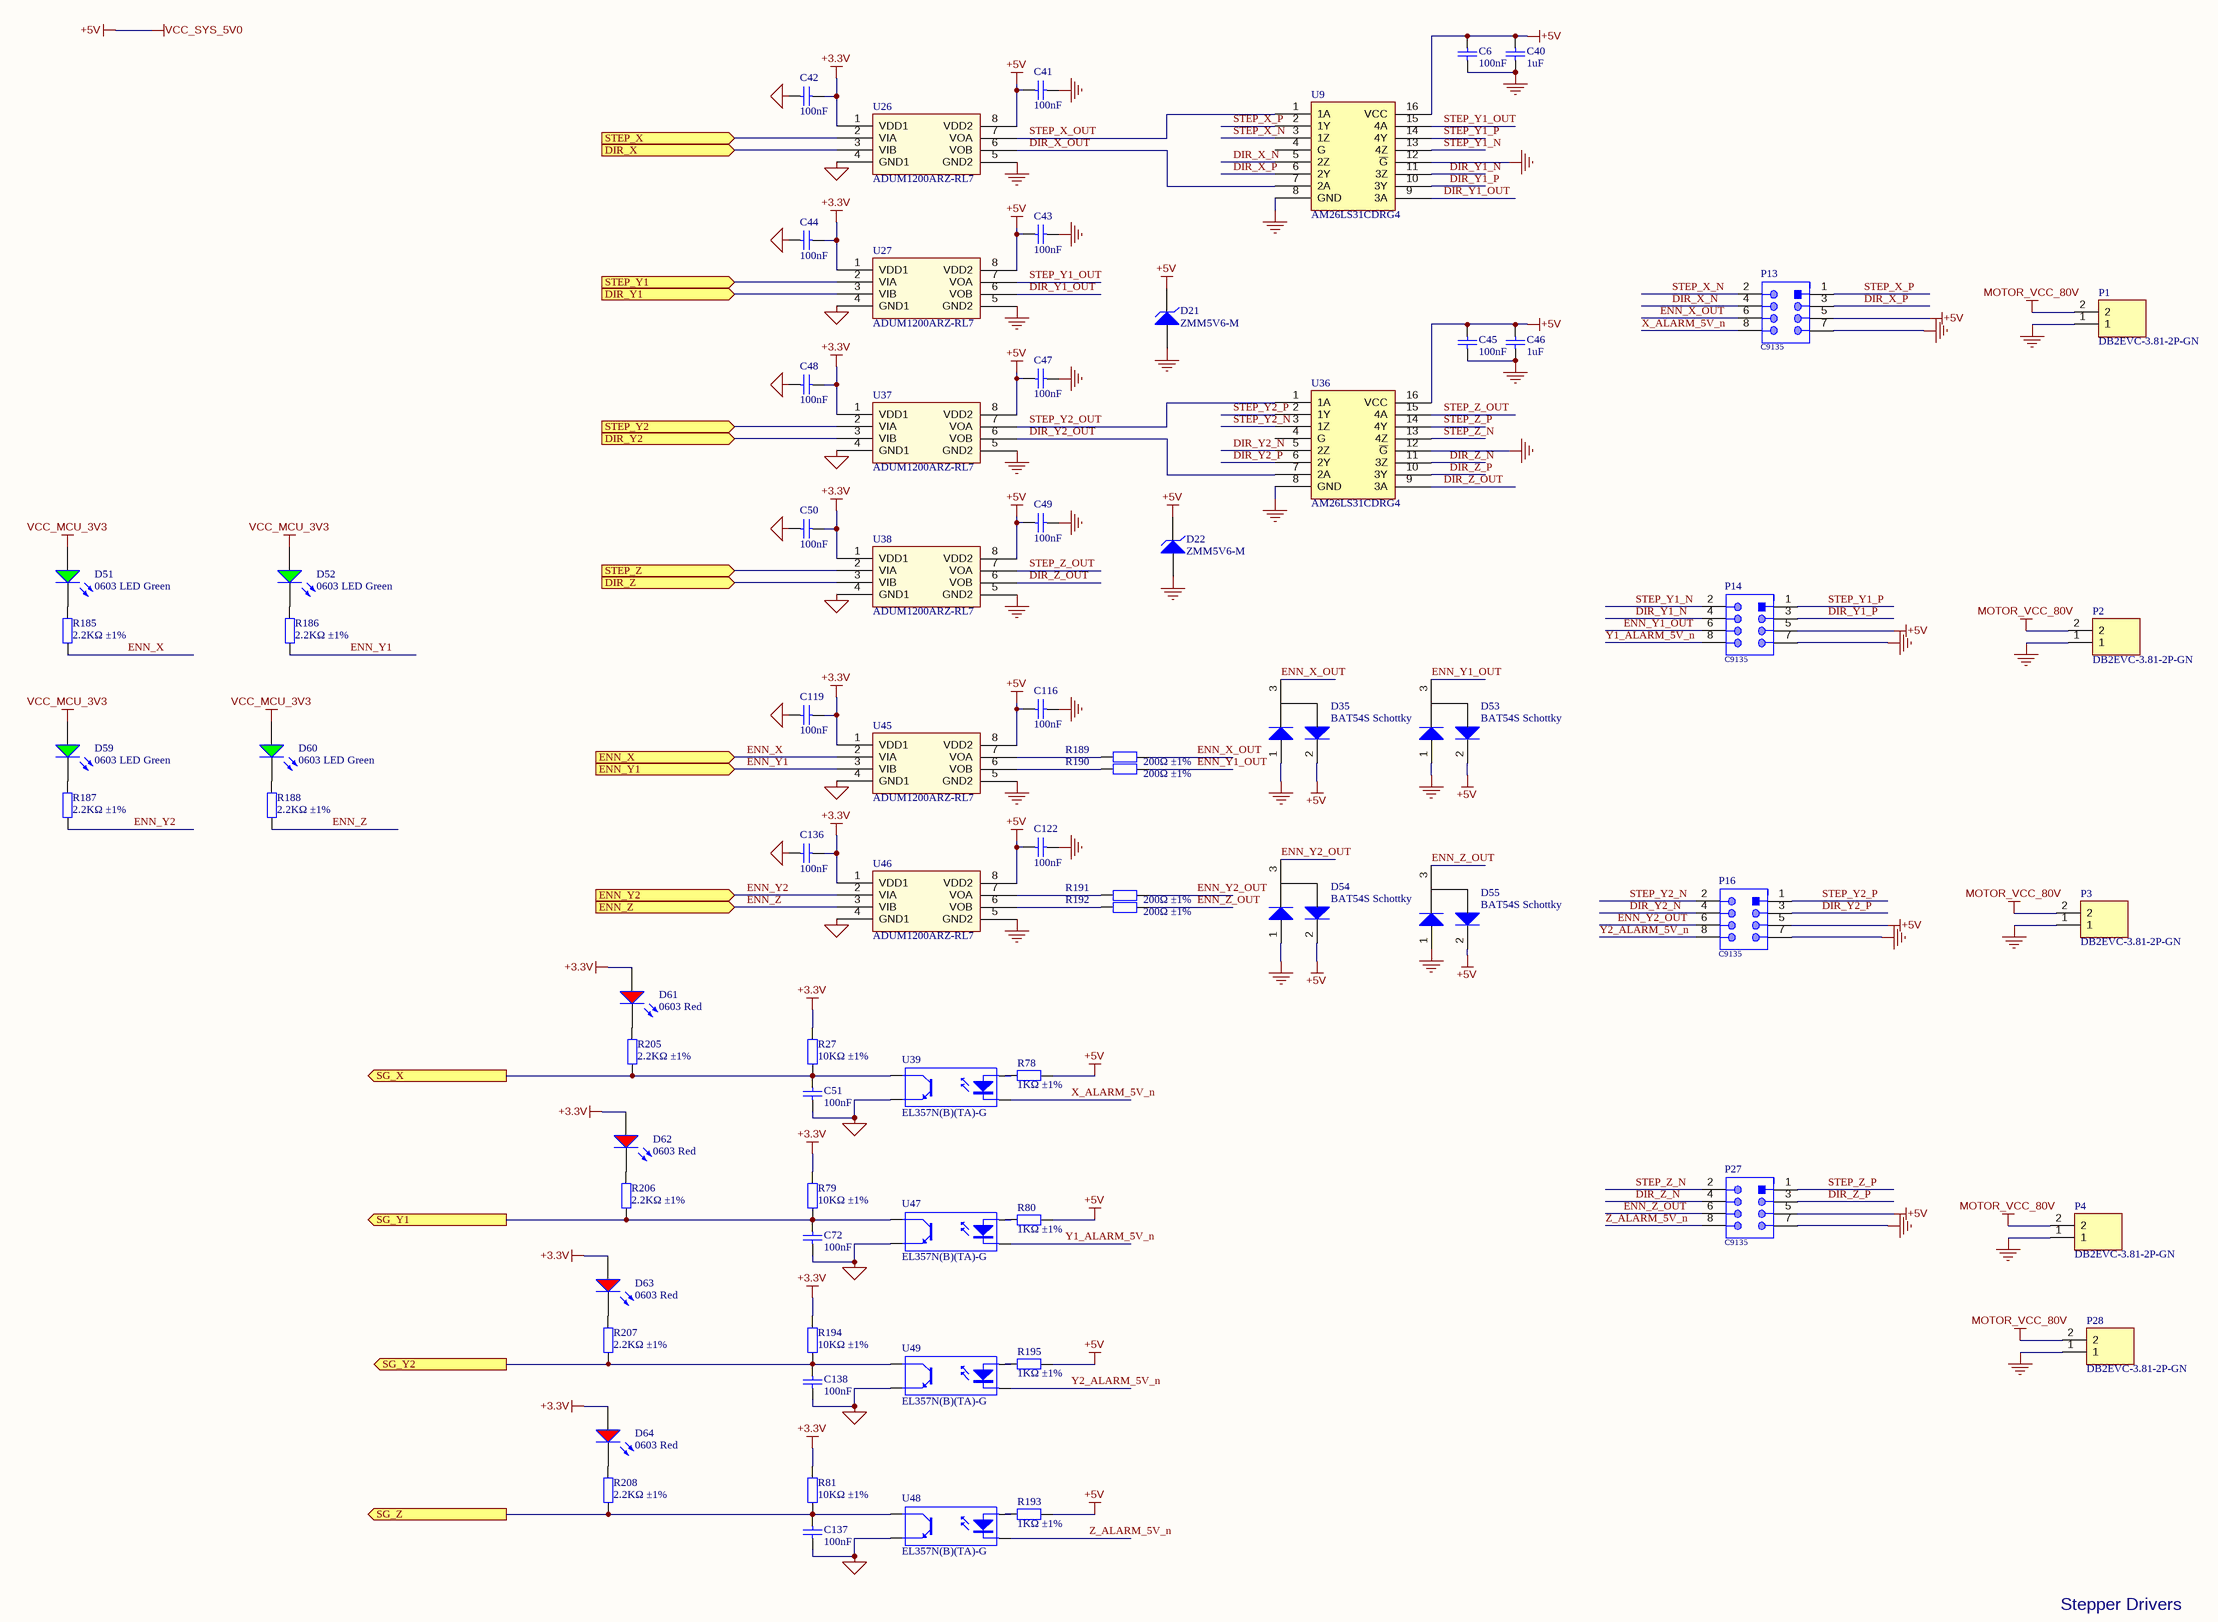
[diagram p16: Stepper_driver_group.SchDoc]

### Parts
C6  100nF  [0603_C]
C40  1uF  [0603_C]
C41  100nF  [0603_C]
C42  100nF  [0603_C]
C43  100nF  [0603_C]
C44  100nF  [0603_C]
C45  100nF  [0603_C]
C46  1uF  [0603_C]
C47  100nF  [0603_C]
C48  100nF  [0603_C]
C49  100nF  [0603_C]
C50  100nF  [0603_C]
C51  100nF  [0402_C]
C72  100nF  [0402_C]
C116  100nF  [0603_C]
C119  100nF  [0603_C]
C122  100nF  [0603_C]
C136  100nF  [0603_C]
C137  100nF  [0402_C]
C138  100nF  [0402_C]
D21  ZMM5V6-M  [LL-34]
D22  ZMM5V6-M  [LL-34]
D35  BAT54S Schottky  [SOT-23(SOT-23-3)]
D51  0603 LED Green  [0603_LED_S1 - GREEN]
D52  0603 LED Green  [0603_LED_S1 - GREEN]
D53  BAT54S Schottky  [SOT-23(SOT-23-3)]
D54  BAT54S Schottky  [SOT-23(SOT-23-3)]
D55  BAT54S Schottky  [SOT-23(SOT-23-3)]
D59  0603 LED Green  [0603_LED_S1 - GREEN]
D60  0603 LED Green  [0603_LED_S1 - GREEN]
D61  0603 Red  [0603_LED_S1]
D62  0603 Red  [0603_LED_S1]
D63  0603 Red  [0603_LED_S1]
D64  0603 Red  [0603_LED_S1]
P1  DB2EVC-3.81-2P-GN  [CONN-TH_5P-P3.81_DB2EVC-3.81-2p]
P2  DB2EVC-3.81-2P-GN  [CONN-TH_5P-P3.81_DB2EVC-3.81-2p]
P3  DB2EVC-3.81-2P-GN  [CONN-TH_5P-P3.81_DB2EVC-3.81-2p]
P4  DB2EVC-3.81-2P-GN  [CONN-TH_5P-P3.81_DB2EVC-3.81-2p]
P13  C9135  [61200821621]
P14  C9135  [61200821621]
P16  C9135  [61200821621]
P27  C9135  [61200821621]
P28  DB2EVC-3.81-2P-GN  [CONN-TH_5P-P3.81_DB2EVC-3.81-2p]
R27  10KΩ ±1%  [0402_R]
R78  1KΩ ±1%  [0603_R]
R79  10KΩ ±1%  [0402_R]
R80  1KΩ ±1%  [0603_R]
R81  10KΩ ±1%  [0402_R]
R185  2.2KΩ ±1%  [0402_R]
R186  2.2KΩ ±1%  [0402_R]
R187  2.2KΩ ±1%  [0402_R]
R188  2.2KΩ ±1%  [0402_R]
R189  200Ω ±1%  [0603_R]
R190  200Ω ±1%  [0603_R]
R191  200Ω ±1%  [0603_R]
R192  200Ω ±1%  [0603_R]
R193  1KΩ ±1%  [0603_R]
R194  10KΩ ±1%  [0402_R]
R195  1KΩ ±1%  [0603_R]
R205  2.2KΩ ±1%  [0402_R]
R206  2.2KΩ ±1%  [0402_R]
R207  2.2KΩ ±1%  [0402_R]
R208  2.2KΩ ±1%  [0402_R]
U9  AM26LS31CDRG4  [SOIC-16_150mil]
U26  ADUM1200ARZ-RL7  [SOIC-8_150mil]
U27  ADUM1200ARZ-RL7  [SOIC-8_150mil]
U36  AM26LS31CDRG4  [SOIC-16_150mil]
U37  ADUM1200ARZ-RL7  [SOIC-8_150mil]
U38  ADUM1200ARZ-RL7  [SOIC-8_150mil]
U39  EL357N(B)(TA)-G  [SOP-4_P2.54]
U45  ADUM1200ARZ-RL7  [SOIC-8_150mil]
U46  ADUM1200ARZ-RL7  [SOIC-8_150mil]
U47  EL357N(B)(TA)-G  [SOP-4_P2.54]
U48  EL357N(B)(TA)-G  [SOP-4_P2.54]
U49  EL357N(B)(TA)-G  [SOP-4_P2.54]

### Ports
DIR_X (in), DIR_Y1 (in), DIR_Y2 (in), DIR_Z (in), ENN_X (in), ENN_Y1 (in), ENN_Y2 (in), ENN_Z (in), SG_X (out), SG_Y1 (out), SG_Y2 (out), SG_Z (out), STEP_X (in), STEP_Y1 (in), STEP_Y2 (in), STEP_Z (in)

### Nets
GND: C6.2 C40.2 C41.1 C43.1 C45.2 C46.2 C47.1 C49.1 C116.1 C122.1 D21.1(A) D22.1(A) D35.1(A) D53.1(A) D54.1(A) D55.1(A) P1.1 P2.1 P3.1 P4.1 P13.7 P14.7 P16.7 P27.7 P28.1 U9.8(GND) U9.12(~{G}) U26.5(GND2) U27.5(GND2) U36.8(GND) U36.12(~{G}) U37.5(GND2) U38.5(GND2) U45.5(GND2) U46.5(GND2)
MCU_GND: C42.2 C44.2 C48.2 C50.2 C51.1 C72.1 C119.2 C136.2 C137.1 C138.1 U26.4(GND1) U27.4(GND1) U37.4(GND1) U38.4(GND1) U39.3(E) U45.4(GND1) U46.4(GND1) U47.3(E) U48.3(E) U49.3(E)
MOTOR_VCC_80V: P1.2 P2.2 P3.2 P4.2 P28.2
VCC_MCU_3V3: C42.1 C44.1 C48.1 C50.1 C119.1 C136.1 D51.A D52.A D59.A D60.A D61.A D62.A D63.A D64.A R27.2 R79.2 R81.2 R194.2 U26.1(VDD1) U27.1(VDD1) U37.1(VDD1) U38.1(VDD1) U45.1(VDD1) U46.1(VDD1)  [also labelled +3.3V]
VCC_SYS_5V0: C6.1 C40.1 C41.2 C43.2 C45.1 C46.1 C47.2 C49.2 C116.2 C122.2 D21.2(K) D22.2(K) D35.2(A) D53.2(A) D54.2(A) D55.2(A) P13.5 P14.5 P16.5 P27.5 R78.1 R80.1 R193.1 R195.1 U9.16(VCC) U26.8(VDD2) U27.8(VDD2) U36.16(VCC) U37.8(VDD2) U38.8(VDD2) U45.8(VDD2) U46.8(VDD2)  [also labelled +5V]
DIR_X: U26.3(VIB) ; port DIR_X
DIR_X_N: P13.4 U9.5(2Z)
DIR_X_OUT: U9.7(2A) U26.6(VOB)
DIR_X_P: P13.3 U9.6(2Y)
DIR_Y1: U27.3(VIB) ; port DIR_Y1
DIR_Y1_N: P14.4 U9.11(3Z)
DIR_Y1_OUT: U9.9(3A) U27.6(VOB)
DIR_Y1_P: P14.3 U9.10(3Y)
DIR_Y2: U37.3(VIB) ; port DIR_Y2
DIR_Y2_N: P16.4 U36.5(2Z)
DIR_Y2_OUT: U36.7(2A) U37.6(VOB)
DIR_Y2_P: P16.3 U36.6(2Y)
DIR_Z: U38.3(VIB) ; port DIR_Z
DIR_Z_N: P27.4 U36.11(3Z)
DIR_Z_OUT: U36.9(3A) U38.6(VOB)
DIR_Z_P: P27.3 U36.10(3Y)
ENN_X: R185.1 U45.2(VIA) ; port ENN_X
ENN_X_OUT: D35.3(K) P13.6 R189.2
ENN_Y1: R186.1 R187.1 U45.3(VIB) U46.2(VIA) ; port ENN_Y1, port ENN_Y2  [also labelled ENN_Y2]
ENN_Y1_OUT: D53.3(K) P14.6 R190.2
ENN_Y2_OUT: D54.3(K) P16.6 R191.2
ENN_Z: R188.1 U46.3(VIB) ; port ENN_Z
ENN_Z_OUT: D55.3(K) P27.6 R192.2
SG_X: C51.2 R27.1 R205.1 U39.4(C) ; port SG_X
SG_Y1: C72.2 R79.1 R206.1 U47.4(C) ; port SG_Y1
SG_Y2: C138.2 R194.1 R207.1 U49.4(C) ; port SG_Y2
SG_Z: C137.2 R81.1 R208.1 U48.4(C) ; port SG_Z
STEP_X: U26.2(VIA) ; port STEP_X
STEP_X_N: P13.2 U9.3(1Z)
STEP_X_OUT: U9.1(1A) U26.7(VOA)
STEP_X_P: P13.1 U9.2(1Y)
STEP_Y1: U27.2(VIA) ; port STEP_Y1
STEP_Y1_N: P14.2 U9.13(4Z)
STEP_Y1_OUT: U9.15(4A) U27.7(VOA)
STEP_Y1_P: P14.1 U9.14(4Y)
STEP_Y2: U37.2(VIA) ; port STEP_Y2
STEP_Y2_N: P16.2 U36.3(1Z)
STEP_Y2_OUT: U36.1(1A) U37.7(VOA)
STEP_Y2_P: P16.1 U36.2(1Y)
STEP_Z: U38.2(VIA) ; port STEP_Z
STEP_Z_N: P27.2 U36.13(4Z)
STEP_Z_OUT: U36.15(4A) U38.7(VOA)
STEP_Z_P: P27.1 U36.14(4Y)
X_ALARM_5V_n: P13.8 U39.2(K)
Y1_ALARM_5V_n: P14.8 U47.2(K)
Y2_ALARM_5V_n: P16.8 U49.2(K)
Z_ALARM_5V_n: P27.8 U48.2(K)
NetD51_K: D51.K R185.2
NetD52_K: D52.K R186.2
NetD59_K: D59.K R187.2
NetD60_K: D60.K R188.2
NetD61_K: D61.K R205.2
NetD62_K: D62.K R206.2
NetD63_K: D63.K R207.2
NetD64_K: D64.K R208.2
NetR78_2: R78.2 U39.1(A)
NetR80_2: R80.2 U47.1(A)
NetR189_1: R189.1 U45.7(VOA)
NetR190_1: R190.1 U45.6(VOB)
NetR191_1: R191.1 U46.7(VOA)
NetR192_1: R192.1 U46.6(VOB)
NetR193_2: R193.2 U48.1(A)
NetR195_2: R195.2 U49.1(A)

Not connected (* = marked no-connect by the designer): U9 4(G); U36 4(G)

### Notes on the sheet
- Stepper Drivers
- Expatria Technologies
- SHEET
- PROJECT
- REV
- EMAIL: INFO@EXPATRIA.CA
- 625 Kane Valley Rd.
- Box 2084
- Merritt, BC V1K1B8
- SIZE
- ENGR
- C
- MODIFIED
- DOCUMENT
- /
- Copyright Sienci Labs 2024. This document describes Open Hardware and is licensed under the CERN-OHL-S v2. No warranty is implied or expressed.

### Library data of the parts
C6 C41-C45 C47-C50 C116 C119 C122 C136 = 0603 100nF (104) 10% 50V: Chip capacitors; Manufacturer: YAGEO; Manufacturer Part Number: CC0603KRX7R9BB104; Tolerance: 10%; Voltage: 50V; ComponentLink1Description: Supplier link; ComponentLink1URL: http://www.szlcsc.com/product/details_15331.html; Package: 0603; Supplier: LC; SuppliersPartNumber: C14663; Capacitance: 100nF
C40 C46 = 0603 1uF (105) 10% 50V: Chip capacitors; Manufacturer: Samsung Electro-Mechanics; Manufacturer Part Number: CL10A105KB8NNNC; Tolerance: 10%; Voltage: 50V; ComponentLink1Description: Supplier link; ComponentLink1URL: http://www.szlcsc.com/product/details_16531.html; Package: 0603; Supplier: LC; SuppliersPartNumber: C15849; Capacitance: 1uF
C51 C72 C137 C138 = 0402 100nF (104) 10% 16V: 16V 100nF X7R ±10% 0402 Multilayer Ceramic Capacitors MLCC - SMD/SMT ROHS; Manufacturer: Samsung Electro-Mechanics; Manufacturer Part Number: CL05B104KO5NNNC; ComponentLink1Description: Supplier link; ComponentLink1URL: http://www.szlcsc.com/product/details_1877.html; Package: 0402; Supplier: LC; SuppliersPartNumber: C1525; Capacitance: 100nF; Tolerance: 10%; Voltage: 16V
D21 D22 = LL-34 ZMM5V6-M: Single 500mW 5.2V~6V 5.6V LL-34 Zener Diodes ROHS; Manufacturer: HXY MOSFET; Manufacturer Part Number: ZMM5V6; Package: LL-34; Supplier: LC; SuppliersPartNumber: C5345993
D35 D53-D55 = SOT-23 BAT54S: 30V Dual 200mA 800mV@100mA SOT-23 Schottky Barrier Diodes (SBD) ROHS; Manufacturer: JSMSEMI; ComponentLink1Description: 供应商链接; ComponentLink1URL: http://www.szlcsc.com/product/details_2877.html; Package: SOT-23; Supplier: LC; SuppliersPartNumber: C916425; Manufacturer Part Number: BAT54S
D51 D52 D59 D60 = MHT192UGCT: 20mA -40℃~+85℃ 515nm~530nm Emerald 120° 60mW 0603 Light Emitting Diodes (LED) ROHS; Manufacturer: MEIHUA; Package: 0603; Supplier: LC; SuppliersPartNumber: C389519; Color: Green; Manufacturer Part Number: MHT192UGCT
D61-D64 = KT-0603R: -40℃~+85℃ Red 0603 Light Emitting Diodes (LED) ROHS; Manufacturer: Hubei KENTO Elec; Package: 0603; Supplier: LC; SuppliersPartNumber: C2286; Color: Red; Manufacturer Part Number: KT-0603R; Value: 0603 Red
P1-P4 P28 = DB2EVC-3.81-2P-GN: 3.81mm Green Board Edge/Receptacle-Close Push-Pull,P=3.81mm Pluggable System Terminal Block ROHS; Manufacturer: DIBO; SuppliersPartNumber: C395686; Manufacturer Part Number: DB2EVC-3.81-2P-GN; Supplier: LCSC; Value: DB2EVC-3.81-2P-GN
P13 P14 P16 P27 = 2.54-2*4P: Male Box Header WR-BHD, THT, Vertical, pitch 2.54 mm, 8 pins; Manufacturer: BOOMELE(Boom Precision Elec); Pitch: 2.54mm; SuppliersPartNumber: C9135; Manufacturer Part Number: 2.54-2*4P; Supplier: LC
R27 R79 R81 R194 = 0402 10K (1002) 1%: Chip resistor; Manufacturer: Uniroyal Elec; Manufacturer Part Number: 0402WGF1002TCE; Power: 1/16W; ComponentLink1Description: Supplier link; ComponentLink1URL: http://www.szlcsc.com/product/details_26487.html; Package: 0402; Supplier: LC; SuppliersPartNumber: C25744; Resistance: 10KΩ; Tolerance: 1%
R78 R80 R193 R195 = 0603 1K (1001) 1%: Chip resistor; Manufacturer: Uniroyal Elec; Manufacturer Part Number: 0603WAF1001T5E; Power: 1/10W; ComponentLink1Description: Supplier link; ComponentLink1URL: http://www.szlcsc.com/product/details_21904.html; Package: 0603; Supplier: LC; SuppliersPartNumber: C21190; Resistance: 1KΩ; Tolerance: 1%
R185-R188 R205-R208 = 0402 2.2K (2201) 1%: Chip resistor; Manufacturer: Uniroyal Elec; Manufacturer Part Number: 0402WGF2201TCE; Power: 1/16W; ComponentLink1Description: Supplier link; ComponentLink1URL: http://www.szlcsc.com/product/details_26622.html; Package: 0402; Supplier: LC; SuppliersPartNumber: C25879; Resistance: 2.2KΩ; Tolerance: 1%
R189-R192 = 0603 200R (2000) 1%: Chip resistor; Manufacturer: Uniroyal Elec; Manufacturer Part Number: 0603WAF2000T5E; Power: 1/10W; ComponentLink1Description: Supplier link; ComponentLink1URL: http://www.szlcsc.com/product/details_8708.html; Package: 0603; Supplier: LC; SuppliersPartNumber: C8218; Resistance: 200Ω; Tolerance: 1%
U9 U36 = AM26LS31CDRG4_[C6179]: 4/0 Driver - RS422, RS485 16-SOIC; Manufacturer: Texas Instruments; ComponentLink1Description: 供应商链接; ComponentLink1URL: http://www.szlcsc.com/product/details_6645.html; Package: SOIC-16_150mil; Supplier: LC; SuppliersPartNumber: C6179; Manufacturer Part Number: AM26LS31CDR
U26 U27 U37 U38 U45 U46 = ADUM1200ARZ-RL7: Dual Channel Isolator; Manufacturer: Analog Devices; Package: SOIC-8_150mil; Supplier: LC; SuppliersPartNumber: C15219; ComponentLink1Description: 供应商链接; ComponentLink1URL: http://www.szlcsc.com/product/details_10199.html; Manufacturer Part Number: ADUM1200ARZ-RL7
U39 U47-U49 = EL357N(B)(TA)-G_[C6649]: Optocoupler SOP-4, EL357N(B)(TA)-G, Everlight Electronics; Package: SOP-4_P2.54; Supplier: LC; SuppliersPartNumber: C6649; Manufacturer: Everlight; Manufacturer Part Number: EL357N(B)(TA)-G

## Sheet Aux_Outputs.SchDoc: RP2040 CNC
size B; Author: AM; CompanyName: Expatria Technologies; DrawnBy: A.Marles; Engineer: AM; Organization: Expatria Technolgoies; Address1: PO Box 2084; Address3: Merritt, BC V1K 1B8; Address4: Canada; DocumentNumber: 9; Revision: B9; SheetNumber: 9; SheetTotal: 27
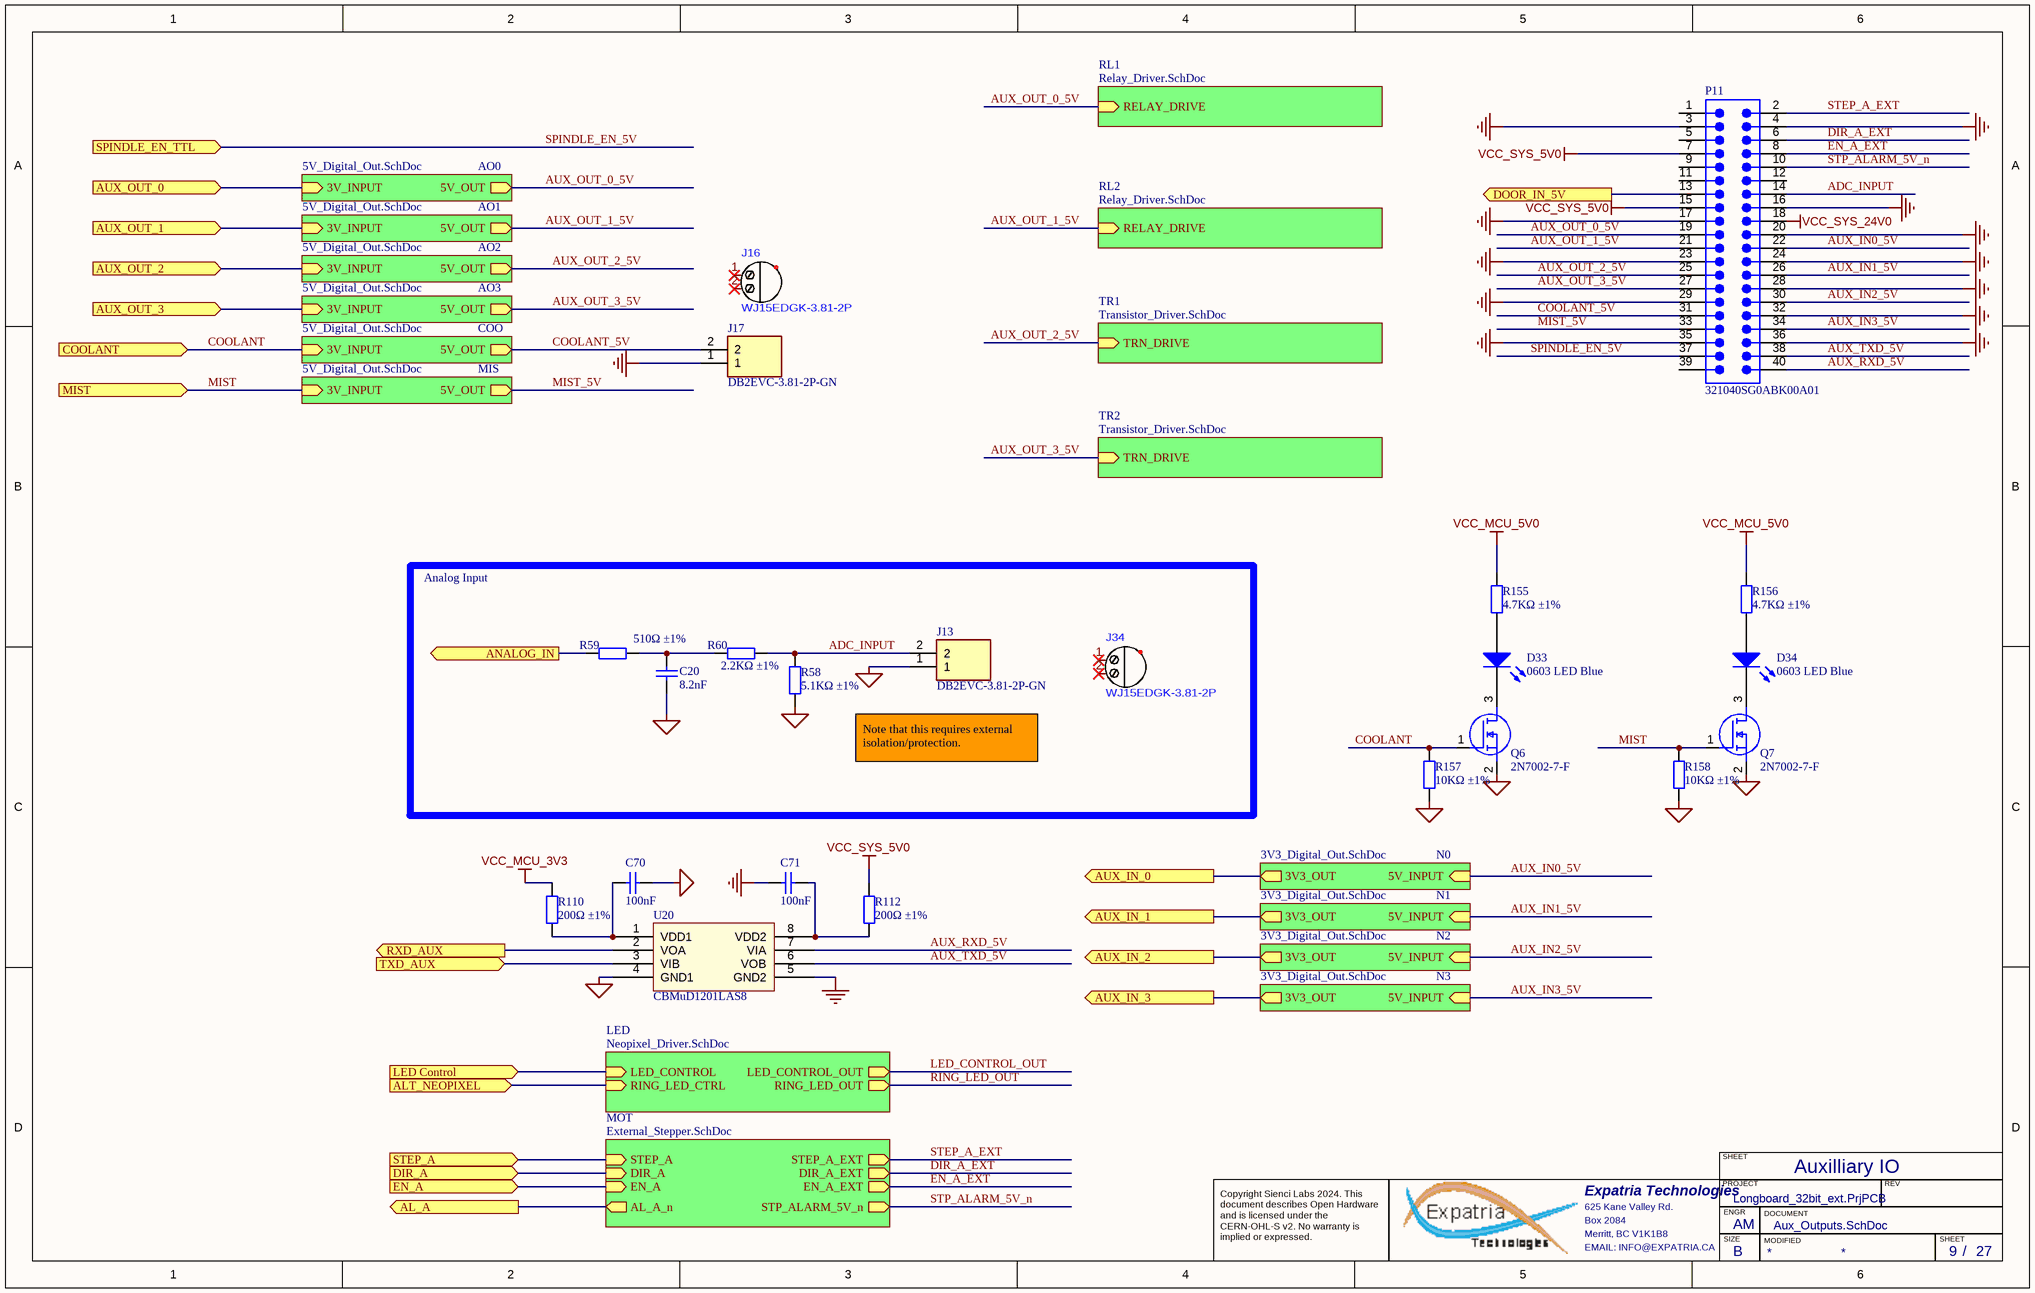
[diagram p17: Aux_Outputs.SchDoc]

### Parts
C20  8.2nF  [0603_C]
C70  100nF  [0402_C]
C71  100nF  [0402_C]
D33  0603 LED Blue  [0603_LED_S1 - BLUE]
D34  0603 LED Blue  [0603_LED_S1 - BLUE]
J13  DB2EVC-3.81-2P-GN  [CONN-TH_5P-P3.81_DB2EVC-3.81-2p]
J16  WJ15EDGK-3.81-2P  (mechanical)
J17  DB2EVC-3.81-2P-GN  [CONN-TH_5P-P3.81_DB2EVC-3.81-2p]
J34  WJ15EDGK-3.81-2P  (mechanical)
P11  321040SG0ABK00A01  [IDC-TH_40P-P2.54_321040SG0ABK00A01]
Q6  2N7002-7-F  [SOT-23(SOT-23-3)]
Q7  2N7002-7-F  [SOT-23(SOT-23-3)]
R58  5.1KΩ ±1%  [0402_R]
R59  510Ω ±1%  [0402_R]
R60  2.2KΩ ±1%  [0402_R]
R110  200Ω ±1%  [0402_R]
R112  200Ω ±1%  [0402_R]
R155  4.7KΩ ±1%  [0402_R]
R156  4.7KΩ ±1%  [0402_R]
R157  10KΩ ±1%  [0603_R]
R158  10KΩ ±1%  [0603_R]
U20  CBMuD1201LAS8  [SOIC-8_150mil]

### Blocks framed on the sheet
Analog Input: C20 J13 J34 R58-R60

### Sub-sheets
AO0 = 5V_Digital_Out.SchDoc: 5V_OUT (out), 3V_INPUT (in)
AO1 = 5V_Digital_Out.SchDoc: 5V_OUT (out), 3V_INPUT (in)
AO2 = 5V_Digital_Out.SchDoc: 5V_OUT (out), 3V_INPUT (in)
AO3 = 5V_Digital_Out.SchDoc: 5V_OUT (out), 3V_INPUT (in)
COO = 5V_Digital_Out.SchDoc: 5V_OUT (out), 3V_INPUT (in)
LED = Neopixel_Driver.SchDoc: LED_CONTROL (in), LED_CONTROL_OUT (out), RING_LED_OUT (out), RING_LED_CTRL (in)
MIS = 5V_Digital_Out.SchDoc: 5V_OUT (out), 3V_INPUT (in)
MOT = External_Stepper.SchDoc: STEP_A (in), EN_A (in), AL_A_n (out), DIR_A (in), EN_A_EXT (out), DIR_A_EXT (out), STP_ALARM_5V_n (out), STEP_A_EXT (out)
N0 = 3V3_Digital_Out.SchDoc: 3V3_OUT (out), 5V_INPUT (in)
N1 = 3V3_Digital_Out.SchDoc: 3V3_OUT (out), 5V_INPUT (in)
N2 = 3V3_Digital_Out.SchDoc: 3V3_OUT (out), 5V_INPUT (in)
N3 = 3V3_Digital_Out.SchDoc: 3V3_OUT (out), 5V_INPUT (in)
RL1 = Relay_Driver.SchDoc: RELAY_DRIVE (in)
RL2 = Relay_Driver.SchDoc: RELAY_DRIVE (in)
TR1 = Transistor_Driver.SchDoc: TRN_DRIVE (in)
TR2 = Transistor_Driver.SchDoc: TRN_DRIVE (in)

### Ports
AL_A (out), ALT_NEOPIXEL (in), ANALOG_IN (out), AUX_IN_0 (out), AUX_IN_1 (out), AUX_IN_2 (out), AUX_IN_3 (out), AUX_OUT_0 (in), AUX_OUT_1 (in), AUX_OUT_2 (in), AUX_OUT_3 (in), COOLANT (in), DIR_A (in), DOOR_IN_5V (out), EN_A (in), LED Control (in), MIST (in), RXD_AUX (out), SPINDLE_EN_TTL (in), STEP_A (in), TXD_AUX (in)

### Nets
GND: C71.1 J17.1 P11.3 P11.4 P11.16 P11.17 P11.20 P11.23 P11.24 P11.28 P11.29 P11.32 P11.35 P11.36 U20.5(GND2)
MCU_GND: C20.1 C70.2 J13.1 Q6.2(S) Q7.2(S) R58.1 R157.1 R158.1 U20.4(GND1)
VCC_MCU_3V3: R110.1
VCC_MCU_5V0: R155.2 R156.2
VCC_SYS_5V0: P11.7 P11.15 R112.1
VCC_SYS_24V0: P11.18
ADC_INPUT: J13.2 P11.14 R58.2 R60.2
AL_A: port AL_A, sheet MOT/AL_A_n
ANALOG_IN: R59.1 ; port ANALOG_IN
AUX_IN0_5V: P11.22 ; sheet N0/5V_INPUT
AUX_IN1_5V: P11.26 ; sheet N1/5V_INPUT
AUX_IN2_5V: P11.30 ; sheet N2/5V_INPUT
AUX_IN3_5V: P11.34 ; sheet N3/5V_INPUT
AUX_IN_0: port AUX_IN_0, sheet N0/3V3_OUT
AUX_IN_1: port AUX_IN_1, sheet N1/3V3_OUT
AUX_IN_2: port AUX_IN_2, sheet N2/3V3_OUT
AUX_IN_3: port AUX_IN_3, sheet N3/3V3_OUT
AUX_OUT_0_5V: P11.19 ; sheet RL1/RELAY_DRIVE, sheet AO0/5V_OUT
AUX_OUT_1_5V: P11.21 ; sheet RL2/RELAY_DRIVE, sheet AO1/5V_OUT
AUX_OUT_2_5V: P11.25 ; sheet TR1/TRN_DRIVE, sheet AO2/5V_OUT
AUX_OUT_3_5V: P11.27 ; sheet AO3/5V_OUT, sheet TR2/TRN_DRIVE
AUX_RXD_5V: P11.40 U20.7(VIA)
AUX_TXD_5V: P11.38 U20.6(VOB)
AUXOUT_0: port AUX_OUT_0, sheet AO0/3V_INPUT
AUXOUT_1: port AUX_OUT_1, sheet AO1/3V_INPUT
AUXOUT_2: port AUX_OUT_2, sheet AO2/3V_INPUT
AUXOUT_3: port AUX_OUT_3, sheet AO3/3V_INPUT
COOLANT: Q6.1(G) R157.2 ; port COOLANT, sheet COO/3V_INPUT
COOLANT_5V: J17.2 P11.31 ; sheet COO/5V_OUT
DIR_A: port DIR_A, sheet MOT/DIR_A
DIR_A_EXT: P11.6 ; sheet MOT/DIR_A_EXT
DOOR_IN_5V: P11.13 ; port DOOR_IN_5V
EN_A_EXT: P11.8 ; sheet MOT/EN_A_EXT
LED Control: port LED Control, sheet LED/LED_CONTROL
MIST: Q7.1(G) R158.2 ; port MIST, sheet MIS/3V_INPUT
MIST_5V: P11.33 ; sheet MIS/5V_OUT
RXD_AUX: U20.2(VOA) ; port RXD_AUX
SPINDLE_EN_5V: P11.37 ; port SPINDLE_EN_TTL
STEP_A: port STEP_A, sheet MOT/STEP_A
STEP_A_EXT: P11.2 ; sheet MOT/STEP_A_EXT
STEP_EN_A: port EN_A, sheet MOT/EN_A
STP_ALARM_5V_n: P11.10 ; sheet MOT/STP_ALARM_5V_n
SWDIO: port ALT_NEOPIXEL, sheet LED/RING_LED_CTRL
TXD_AUX: U20.3(VIB) ; port TXD_AUX
NetC20_2: C20.2 R59.2 R60.1
NetC70_1: C70.1 R110.2 U20.1(VDD1)
NetC71_2: C71.2 R112.2 U20.8(VDD2)
NetD33_A: D33.A R155.1
NetD33_K: D33.K Q6.3(D)
NetD34_A: D34.A R156.1
NetD34_K: D34.K Q7.3(D)

Not connected (* = marked no-connect by the designer): J16 1* 2*; J34 1* 2*; P11 1 5 9 11 12 39

### Notes on the sheet
- Note that this requires external isolation/protection.
- Auxilliary IO
- SHEET
- Expatria Technologies
- 625 Kane Valley Rd.
- Box 2084
- Merritt, BC V1K1B8
- PROJECT
- SIZE
- ENGR
- MODIFIED
- DOCUMENT
- REV
- Copyright Sienci Labs 2024. This document describes Open Hardware and is licensed under the CERN-OHL-S v2. No warranty is implied or expressed.
- EMAIL: INFO@EXPATRIA.CA
- B
- /

### Library data of the parts
C20 = 0603 8.2nF (822) 10% 50V: 50V 8.2nF X7R ±10% 0603 Multilayer Ceramic Capacitors MLCC - SMD/SMT ROHS; Manufacturer: YAGEO; Manufacturer Part Number 1: CC0603KRX7R9BB822; Package: 0603; Supplier: LC; SuppliersPartNumber: C113812; Capacitance: 8.2nF; Tolerance: 10%; Voltage: 50V; Manufacturer 1: YAGEO; Value: 8.2nF; Manufacturer Part Number: CC0603KRX7R9BB822
C70 C71 = 0402 100nF (104) 10% 16V: as C51 on sheet Stepper_driver_group; ComponentLink1Description: Supplier link; ComponentLink1URL: http://www.szlcsc.com/product/details_1877.html; Package: 0402; Supplier: LC; SuppliersPartNumber: C1525; Capacitance: 100nF; Tolerance: 10%; Voltage: 16V
D33 D34 = 0603 LED Blue: 5mA -40℃~+85℃ Blue 120° 0603 Light Emitting Diodes (LED) ROHS; Manufacturer: TUOZHAN; Manufacturer Part Number: F.0603.00026/P2-0603B1TS2-06T-001; Package: 0603; Supplier: LC; SuppliersPartNumber: C7496819; Color: Blue
J13 J17 = DB2EVC-3.81-2P-GN: as P1-P4 on sheet Stepper_driver_group; Manufacturer Part Number: DB2EVC-3.81-2P-GN; SuppliersPartNumber: C395686; Supplier: LCSC; Value: DB2EVC-3.81-2P-GN
J16 J34 = WJ15EDGK-3.81-2P: 2 1 3.81mm Green Plug P=3.81mm Pluggable System Terminal Block ROHS; Manufacturer: Ningbo; Supplier: LCSC; Supplier Part Number 1: C8466; Manufacturer Part Number: WJ15EDGK-3.81-2P; RoHS: Yes; SuppliersPartNumber: C8466
P11 = 321040SG0ABK00A01: 2.54mm Straight Gold Brass 20 Push - Pull 2.54mm 2 Straight,P=2.54mm IDC Connectors ROHS; Manufacturer: JILN; SuppliersPartNumber: C601944; Supplier: LCSC; Manufacturer Part Number: 321040SG0ABK00A01
Q6 Q7 = 2N7002-7-F: 60V 115mA 7.5Ω@5V,50mA 370mW N Channel SOT-23 MOSFETs ROHS; Manufacturer: Diodes Inc.; SuppliersPartNumber: C85049; Manufacturer Part Number: 2N7002-7-F; Value: 2N7002-7-F; Datasheet Link: https://datasheet.datasheetarchive.com/originals/distributors/SFDatasheet-0/sf-0003625.pdf; Height: 1.2mm; Manufacturer_Part_Number: 2N7002-7-F; Mouser Part Number: 621-2N7002-F; Mouser Price/Stock: https://www.mouser.co.uk/ProductDetail/Diodes-Incorporated/2N7002-7-F?qs=jMXWnm70%252BC%252BAX%252BMLzUkTZg%3D%3D; Arrow Part Number: 2N7002-7-F; Arrow Price/Stock: https://www.arrow.com/en/products/2n7002-7-f/diodes-incorporated?region=nac
R58 = 0402 5.1K (5101) 1%: Chip resistor; Manufacturer: Uniroyal Elec; Manufacturer Part Number: 0402WGF5101TCE; Power: 1/16W; Resistance: 51.1KΩ; ComponentLink1Description: Supplier link; ComponentLink1URL: http://www.szlcsc.com/product/details_26648.html; Package: 0402; Supplier: LCSC; SuppliersPartNumber: C25905; Tolerance: 1%
R59 = 0402 510R (5100) 1%: Chip resistor; Manufacturer: Uniroyal Elec; Manufacturer Part Number: 0402WGF5100TCE; Power: 1/16W; Package: 0402; Supplier: LC; SuppliersPartNumber: C25123; Resistance: 510Ω; Tolerance: 1%
R60 = 0402 2.2K (2201) 1%: as R185-R188 on sheet Stepper_driver_group; ComponentLink1Description: Supplier link; ComponentLink1URL: http://www.szlcsc.com/product/details_26622.html; Package: 0402; Supplier: LCSC; SuppliersPartNumber: C25879; Resistance: 2.2KΩ; Tolerance: 1%
R110 R112 = 0402 200R (2000) 1%: Chip resistor; Manufacturer: Uniroyal Elec; Manufacturer Part Number: 0402WGF2000TCE; Power: 1/16W; Package: 0402; Supplier: LC; SuppliersPartNumber: C25087; Resistance: 200Ω; Tolerance: 1%; ComponentLink1Description: Supplier link; ComponentLink1URL: http://www.szlcsc.com/product/details_25830.html
R155 R156 = 0402 4.7K (4701) 1%: Chip resistor; Manufacturer: Uniroyal Elec; Manufacturer Part Number: 0402WGF4701TCE; Power: 1/16W; ComponentLink1Description: Supplier link; ComponentLink1URL: http://www.szlcsc.com/product/details_26643.html; Package: 0402; Supplier: LC; SuppliersPartNumber: C25900; Resistance: 4.7KΩ; Tolerance: 1%
R157 R158 = 0603 10K (1002) 1%: Chip resistor; Manufacturer: Uniroyal Elec; Manufacturer Part Number: 0603WAF1002T5E; Power: 1/10W; Package: 0603; Supplier: LC; SuppliersPartNumber: C25804; Resistance: 10KΩ; Tolerance: 1%; ComponentLink1Description: Supplier link; ComponentLink1URL: http://www.szlcsc.com/product/details_26547.html
U20 = CBMuD1201LAS8: Dual Channel Isolator; Manufacturer: Corebai Microelectronics; Package: SOIC-8_150mil; Supplier: LC; SuppliersPartNumber: C476472; ComponentLink1Description: 供应商链接; ComponentLink1URL: http://www.szlcsc.com/product/details_10199.html; Manufacturer Part Number: CBMuD1201LAS8